# Altium schematic sheet TestFile.SchDoc
size A
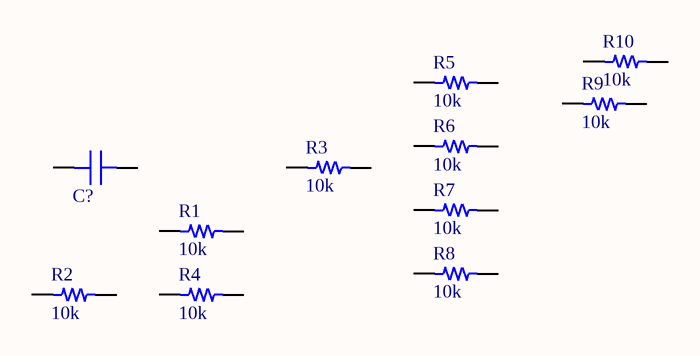
[diagram p0: TestFile.SchDoc]

## Parts
C?  0402 0.1uF Cap  [RES 0402/1005]  (value not drawn)
R1  Resistance: 10k  [RES 0402/1005]  (hidden comment: 0402 Resistor)
R2  Resistance: 10k  [RES 0402/1005]  (hidden comment: 0402 Resistor)
R3  Resistance: 10k  [RES 0402/1005]  (hidden comment: 1% 0402 Resistor thing)
R4  Resistance: 10k  [RES 0402/1005]  (hidden comment: 0402 Resistor)
R5  value 10k  [RES 0402/1005]  (hidden comment: 0402 Resistor)
R6  value 10k  [RES 0402/1005]  (hidden comment: 0402 Resistor)
R7  value 10k  [RES 0402/1005]  (hidden comment: 0402 Resistor)
R8  value 10k  [RES 0402/1005]  (hidden comment: 0402 Resistor)
R9  value 10k  [RES 0402/1005]  (hidden comment: 0402 Resistor)
R10  value 10k  [RES 0402/1005]  (hidden comment: 0402 Resistor)

## Nets

Not connected (* = marked no-connect by the designer): C? 1 2; R1 1 2; R2 1 2; R3 1 2; R4 1 2; R5 1 2; R6 1 2; R7 1 2; R8 1 2; R9 1 2; R10 1 2

## Library data of the parts
C? = 2001: 0.1µF 16V Ceramic Capacitor Y5V (F) 0402 (1005 Metric) 0.039" L x 0.020" W (1.00mm x 0.50mm); Manufacturer: Samsung Electro-Mechanics; MfrPartNo: CL05F104ZO5NNNC; idCap: 2001; Name: Cap_0402_16V_0.1uF_Y5V; Created_By: Nick Mah; Location: A1; Value: 0.1uF; Capacitance: 0.1uF; Voltage Rating: 16V; Dieletric: Y5V; Package: 0402; Link: https://www.digikey.com/product-detail/en/samsung-electro-mechanics/CL05F104ZO5NNNC/1276-1004-1-ND/3889090; ComponentLink1Description: Datasheet; ComponentLink1URL: http://www.samsungsem.com/kr/support/product-search/mlcc/__icsFiles/afieldfile/2018/07/03/CL05F104ZO5NNNC.pdf; Supplier 1: Digi-Key; Supplier Part Number 1: 1276-1004-1-ND
R1 R2 R4-R10 = 1001: 10 kOhms ±1% 0.2W, 1/5W Chip Resistor 0402 (1005 Metric) Automotive AEC-Q200, Pulse Withstanding Thick Film; Manufacturer: Panasonic Electronic Components; MfrPartNo: ERJ-PA2F1002X; idResistor: 1001; Name: res_0402_10k_1%_1/4W; Power: 1/4W; Created_By: Nick Mah; Check_By: Angel Delgado; Updated_By: Oliver Ousterman; Location: B2; Tolerance: 1%; Package: 0402; Link: https://www.digikey.com/product-detail/en/panasonic-electronic-components/ERJ-PA2F1002X/P17230TR-ND/5402656; Created_Date: 7/22/2018; Checked_Date: 7/23/2019; Updated_Date: 8/1/2018; ComponentLink1Description: Datasheet; ComponentLink1URL: https://industrial.panasonic.com/cdbs/www-dat; Supplier 1: Digi-Key; Supplier Part Number 1: P17230TR-ND
R3 = 1002: 10 kOhms ±1% 0.1W, 1/10W Chip Resistor 0402 (1005 Metric) Anti-Sulfur Thin Film; Manufacturer: Vishay Beyschalg; MfrPartNo: MCS04020C1002FE000; idResistor: 1002; Name: res 0402  10k 1% 1/8W; Created_By: Nick Mah; Check_By: Angel Delgado; Updated_By: Oliver Ousterman; Location: B5; Supplier 1: Digi-Key; Supplier Part Number 1: MCS0402-10.0K-CFCT-ND; Tolerance: 1%; Power: 0.1W; Package: 0402; Link: https://www.digikey.com/product-detail/en/vishay-beyschlag/MCS04020C1002FE000/MCS0402-10.0K-CFCT-ND/2607929; Created_Date: 7/26/2018; Checked_Date: 7/27/2019; Updated_Date: 6/2/2321; ComponentLink1Description: Datasheet; ComponentLink1URL: http://www.vishay.com/docs/28705/mcx0x0xpro.pdf